# EAGLE design rapidshark-half-assed-half-h-bridge-mk-2.1 (EAGLE 7.5.0)
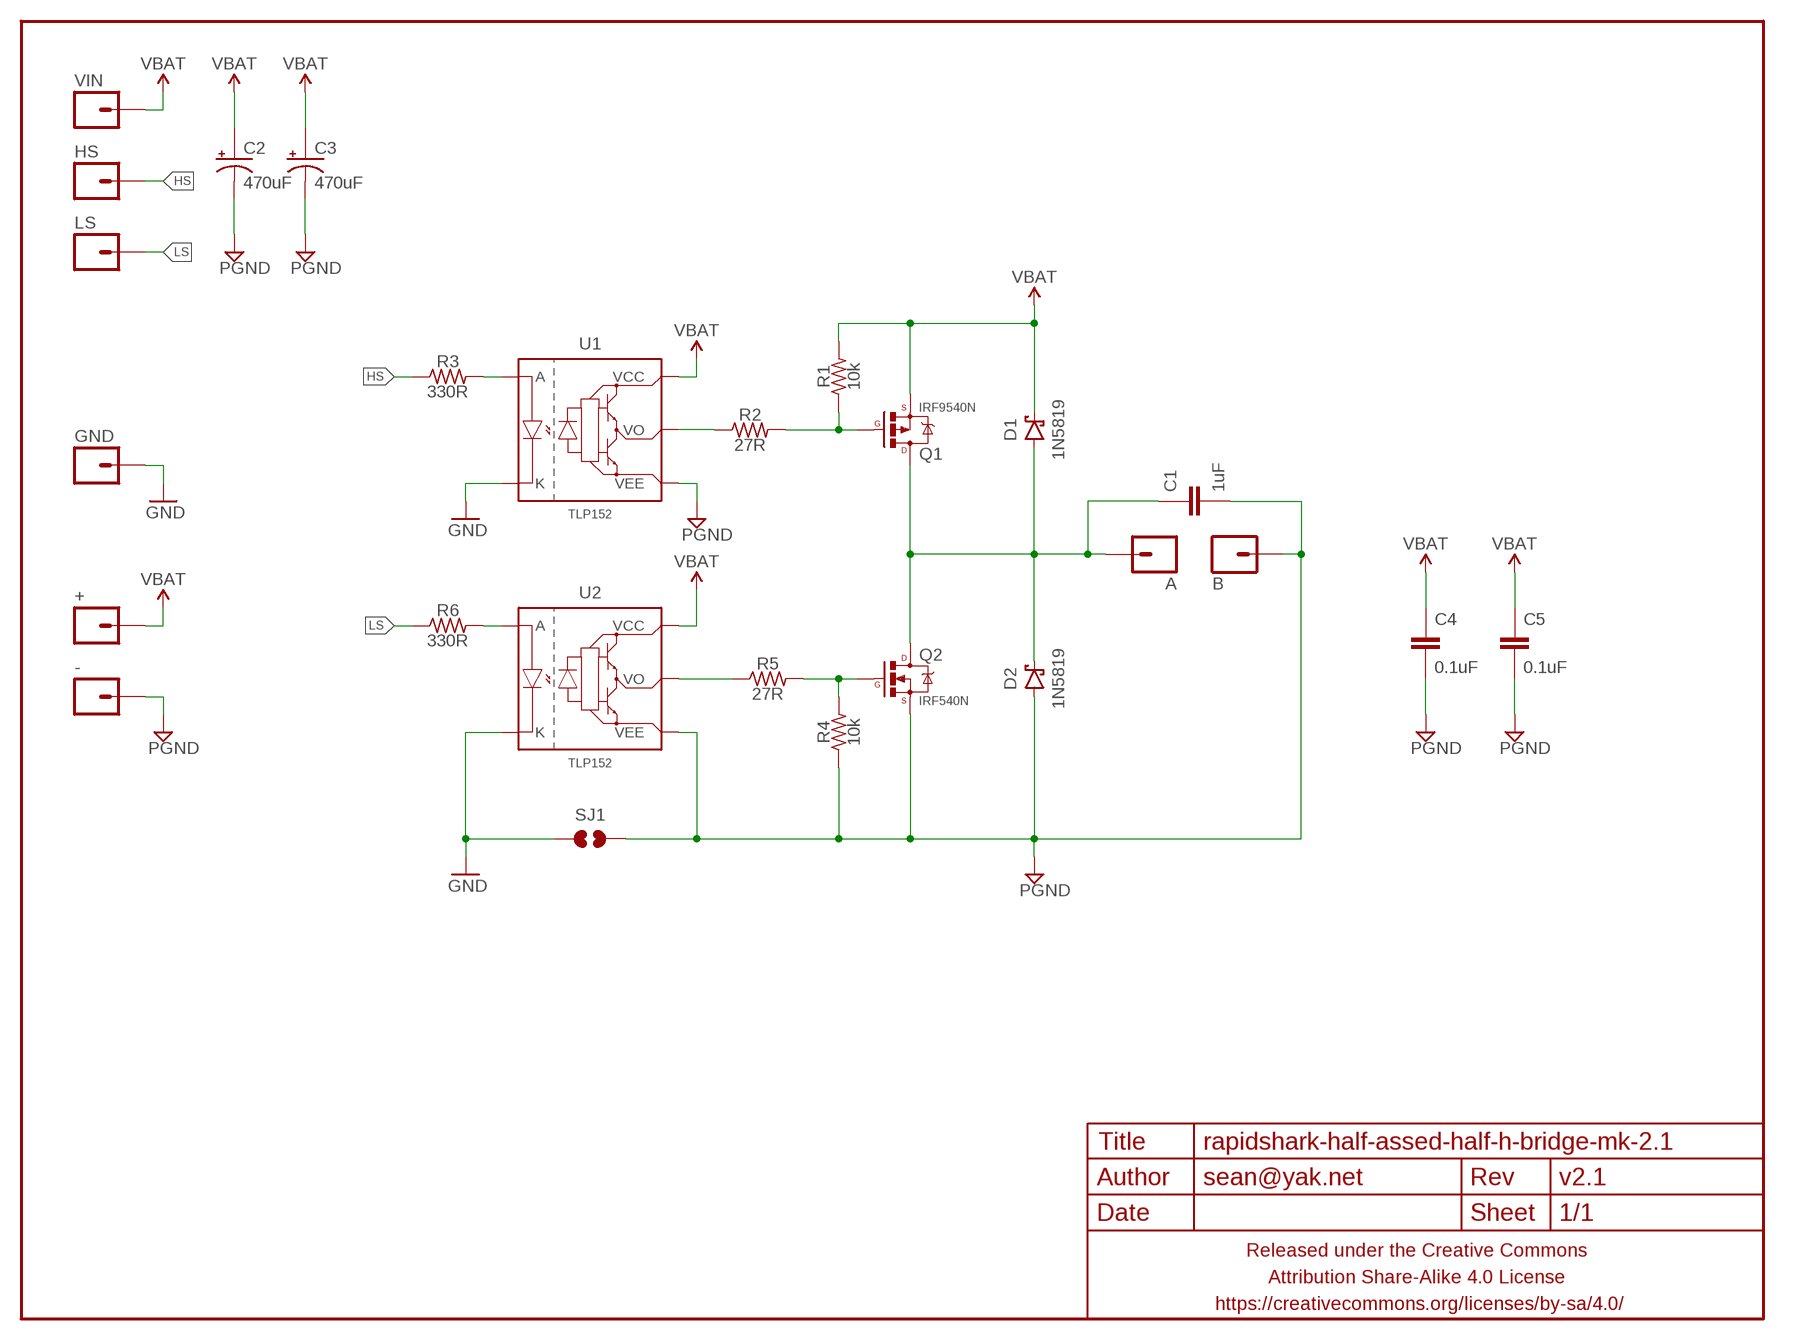
[diagram p0: schematic, sheet 1]

## Parts
+  M01PTH-1.9MM  [1X01-1.9MM-CIR]
-  M01PTH-1.9MM  [1X01-1.9MM-CIR]
A  M01PTH-1.9MM  [1X01-1.9MM-CIR]
B  M01PTH-1.9MM  [1X01-1.9MM-CIR]
C1  1uF  CAPACITOR-CERAMICC0603-TIGHTER  [C0603-TIGHTER]
C2  470uF  CAPACITOR-POLARIZEDE5-10.5  [E5-10,5]
C3  470uF  CAPACITOR-POLARIZEDE5-10.5  [E5-10,5]
C4  0.1uF  CAPACITOR-CERAMICC0603-TIGHTER  [C0603-TIGHTER]
C5  0.1uF  CAPACITOR-CERAMICC0603-TIGHTER  [C0603-TIGHTER]
D1  1N5819  DIODE-SCHOTTKYSMA  [SMA-DIODE-SCHOTTKY]
D2  1N5819  DIODE-SCHOTTKYSMA  [SMA-DIODE-SCHOTTKY]
FRAME1  FRAME-LETTERNO_PACKAGE  [DUMMY]
GND  M01PTH  [1X01]
HS  M01PTH  [1X01]
LS  M01PTH  [1X01]
Q1  IRF9540N  MOSFET-PCHANNELD2PAK  [D2PAK]
Q2  IRF540N  MOSFET-NCHANNELD2PAK  [D2PAK]
R1  10k  RESISTORR0603-TIGHTER  [R0603-TIGHTER]
R2  27R  RESISTORR0603-TIGHTER  [R0603-TIGHTER]
R3  330R  RESISTORR0603-TIGHTER  [R0603-TIGHTER]
R4  10k  RESISTORR0603-TIGHTER  [R0603-TIGHTER]
R5  27R  RESISTORR0603-TIGHTER  [R0603-TIGHTER]
R6  330R  RESISTORR0603-TIGHTER  [R0603-TIGHTER]
SJ1  JUMPER-PAD-2-NO  [PAD-JUMPER-2-NO_NO_SILK]
U1  TLP152  OPTOISOLATOR-GATEDRIVERSOIC05  [SO05]
U2  TLP152  OPTOISOLATOR-GATEDRIVERSOIC05  [SO05]
VIN  M01PTH  [1X01]

## Nets
A: A.P$1 C1.1 D1.A D2.C Q1.D Q2.D
GND: GND.1 SJ1.1 U1.3(K) U2.3(K)
HS: HS.1 R3.1
LS: LS.1 R6.1
N$1: Q2.G R4.2 R5.2
N$2: R2.1 U1.5(VO)
N$3: R6.2 U2.1(A)
N$4: R3.2 U1.1(A)
N$5: Q1.G R1.1 R2.2
N$8: R5.1 U2.5(VO)
PGND: -.P$1 B.P$1 C1.2 C2.- C3.- C4.2 C5.2 D2.A Q2.S R4.1 SJ1.2 U1.4(VEE) U2.4(VEE)
VBAT: +.P$1 C2.+ C3.+ C4.1 C5.1 D1.C Q1.S R1.2 U1.6(VCC) U2.6(VCC) VIN.1

## Library data of the parts
+ - A B GND HS LS VIN = a_parts:M01: Header 1 Standard 1-pin 0.1" header. Use with straight break away headers (SKU : PRT-00116), right angle break away headers (PRT-00553), swiss pins (PRT-00743), machine pins (PRT-00117), and female headers (PRT-00115).
C1 C4 C5 = a_parts:CAPACITOR-CERAMIC: CAPACITOR, European symbol
C2 C3 = a_parts:CAPACITOR-POLARIZED: POLARIZED CAPACITOR, American symbol
D1 D2 = a_parts:DIODE-SCHOTTKY: Schottky diodes in SFE's production catalog BAT20J 1A 23V 0.62Vf RB751 120mA 40V 0.37Vf PMEG4005EJ 0.5A 40V 0.42Vf MBRA140 1A 40V 0.5Vf B340A 3A 40V SMA
FRAME1 = A_butts:FRAME-LETTER: Schematic Frame Standard 8.5x11 US Letter frame; DESIGNER: sean@yak.net; VERSION: v2.1
Q1 = a_parts:MOSFET-PCHANNEL: Generic PMOSFET IRLML2244 - TRANS-11153 (SOT-23 -20V -4.3A) (1.Gate 2.Source 3.Drain) FQP27P06 - COM-10349 <http://www.sparkfun.com/products/10349> (TO-220 -60V -27A) (1.Gate 2.Source 3.Drain)
Q2 = a_parts:MOSFET-NCHANNEL: Common NMOSFET Parts MFG P/N Store ID Prod ID FDD8780 TRANS-09984 SI7820DN TRANS-11055 FDS6630A IC-08089 2N7002PW TRANS-11151 FQP30N06L COM-10213 TRANS-10060 BSS123LT1G TRANS-08345 BSS138 TRANS-00830 BS170 2N7000
R1-R6 = a_parts:RESISTOR: RESISTOR, American symbol
SJ1 = a_parts:JUMPER-PAD-2-NO
U1 U2 = a_parts:OPTOISOLATOR-GATEDRIVER

## Board
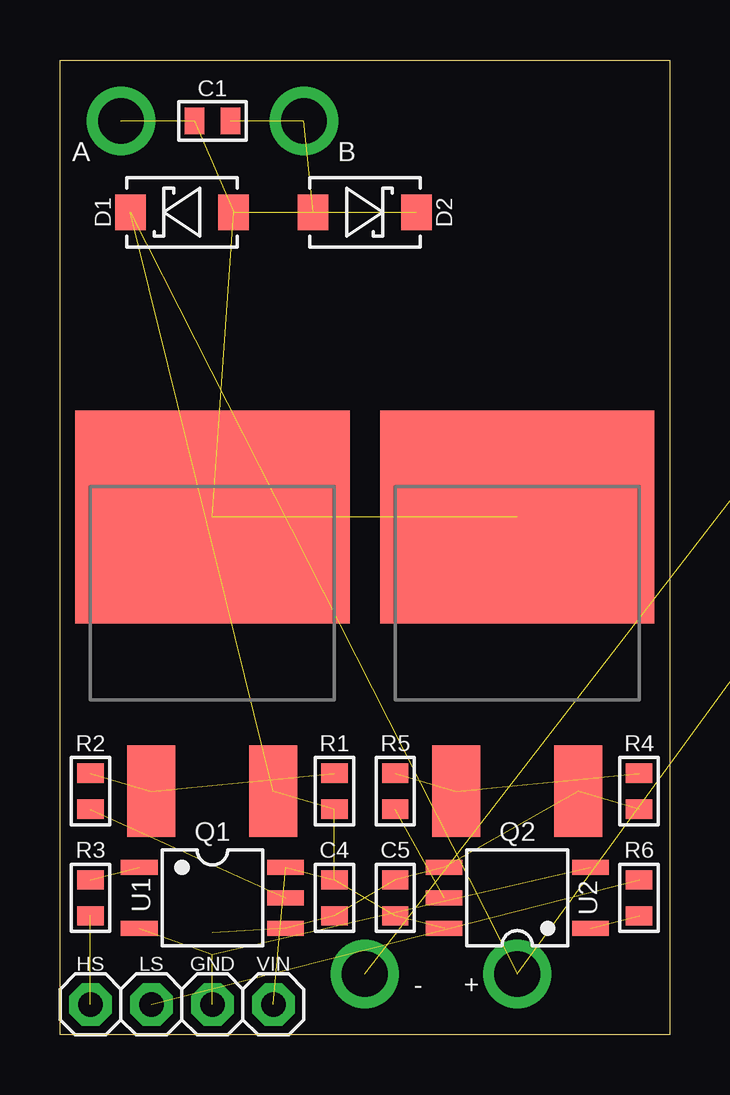
[diagram p1: board, top side]
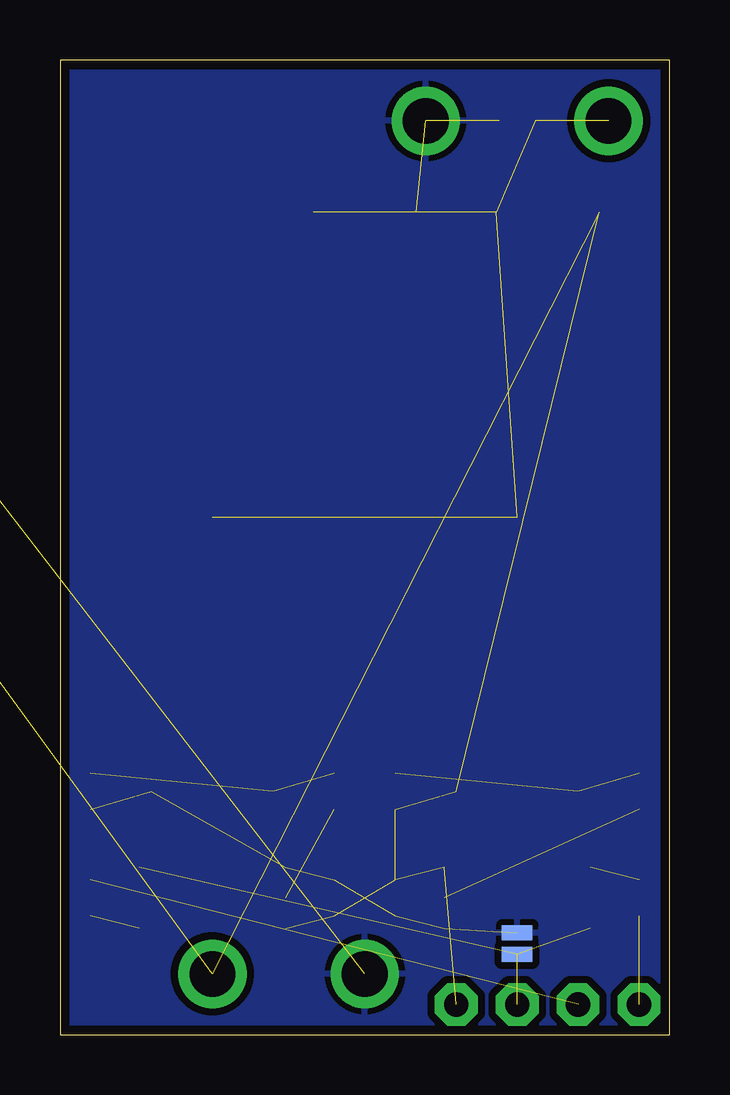
[diagram p2: board, bottom side, seen from below]

Size 25.4 x 40.64 mm. Coordinates in mm from the lower left corner, seen from the top.
Outline: 25.4,0 0,0 0,40.64 25.4,40.64 25.4,0
Copper layers (1*16): Top 0.0356mm / dielectric 1.5011mm / Bottom 0.0356mm
Design rules "LaenPCBOrder_2": minimum track width 6mil, minimum drill 13mil, track to track 6mil, track to pad 6mil, pad to pad 6mil, via to via 6mil, smd to smd 6mil, copper to edge 15mil, drill to drill 6mil, minimum pad ring 7mil, minimum via ring 7mil, stop-mask expansion 3mil, vias tented up to drill 20mil, thermal gap 10mil

### Footprints (pad centres in the part's own frame; a part is rotated, then mirrored left to right if it is on the bottom)
1X01-1.9MM-CIR = drill 1.9 pad 2.6: P$1 0,0
C0603-TIGHTER = smd 0.8 x 1.1: 1 -0.75,0; 2 0.75,0
E5-10,5 = drill 1.016 pad 1.93 square: + -2.54,0 | drill 1.016 pad 1.93 octagon: - 2.54,0
SMA-DIODE-SCHOTTKY = smd 1.27 x 1.47: A -2.15,0; C 2.15,0
1X01 = drill 1.016 pad 1.778 octagon: 1 0,0
D2PAK = smd 11.43 x 8.89: D 0,11.43 | smd 2 x 3.81: G -2.54,0; S 2.54,0
R0603-TIGHTER = smd 0.8 x 1.1: 1 -0.75,0; 2 0.75,0
PAD-JUMPER-2-NO_NO_SILK = smd 0.635 x 1.27: 1 -0.45,0; 2 0.45,0
SO05 = smd 0.635 x 1.524: 1 -1.27,-3.048; 3 1.27,-3.048; 4 1.27,3.048; 5 0,3.048; 6 -1.27,3.048

### Placement (x,y rotation side)
+  19.05,2.54 90 top
-  12.7,2.54 270 top
A  2.54,38.1 270 top
B  10.16,38.1 0 top
C1  6.35,38.1 0 top
C2  37.78,31.75 180 top  (outside the outline)
C3  41.27,26.67 180 top  (outside the outline)
C4  11.43,5.71 270 top
C5  13.97,5.71 90 top
D1  5.08,34.29 180 top
D2  12.7,34.29 0 top
FRAME1  0,0 0 bottom
GND  6.35,1.27 0 top
HS  1.27,1.27 0 top
LS  3.81,1.27 0 top
Q1  6.35,10.16 0 top
Q2  19.05,10.16 0 top
R1  11.43,10.16 270 top
R2  1.27,10.16 90 top
R3  1.27,5.71 90 top
R4  24.13,10.16 90 top
R5  13.97,10.16 90 top
R6  24.13,5.71 270 top
SJ1  6.35,3.81 90 bottom
U1  6.35,5.71 270 top
U2  19.05,5.71 90 top
VIN  8.89,1.27 0 top

### Tracks (layer width: path | path; a pad name or v marks a point on that pad's centre or on a via)
A  (5 unrouted)
GND  (3 unrouted)
HS  (1 unrouted)
LS  (1 unrouted)
N$1  (2 unrouted)
N$2  (1 unrouted)
N$3  (1 unrouted)
N$4  (1 unrouted)
N$5  (2 unrouted)
N$8  (1 unrouted)
PGND  (10 unrouted)
  pour Bottom (isolate 0.305, rank 5): 25.4,40.64 25.4,0 0,0 0,40.64
VBAT  (10 unrouted)